# Altium schematic sheet IgnMOSFET.SchDoc
size A4
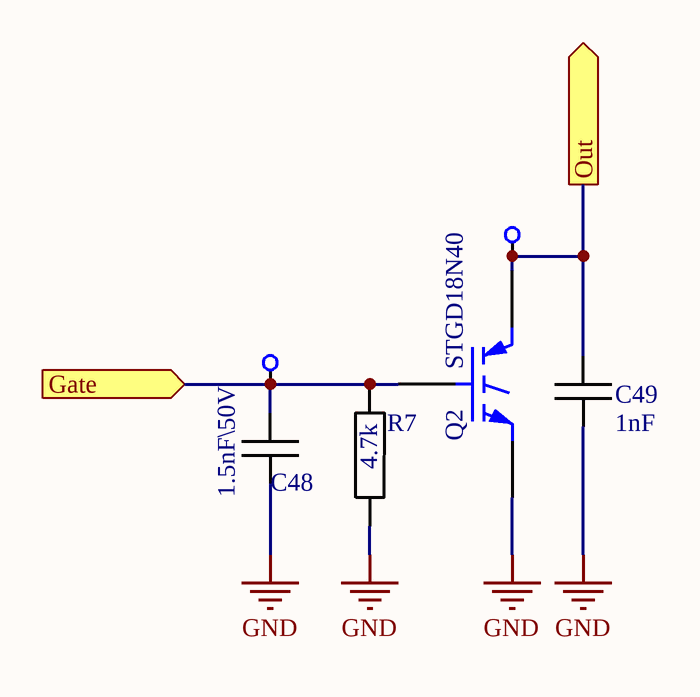
[diagram p0: IgnMOSFET.SchDoc]

## Parts
C48  1.5nF\50V  [SMD 0603]
C49  1nF  [SMD 0603]
Q2  STGD18N40  [DPAK228P991X238-3M]
R7  4.7k  [SMD 0603]
TP29  TestPoint  [TESTPOINT]  (value not drawn)
TP30  TestPoint  [TESTPOINT]  (value not drawn)

## Ports
Gate (in), Out (out)

## Nets
GND: C48.1 C49.1 Q2.3(E) R7.1
Gate: C48.2 Q2.1(G) R7.2 TP29.0 ; port Gate
Out: C49.2 Q2.4(C) TP30.0 ; port Out

## Library data of the parts
C48 = Capasitor: CC0603KRX7R9BB152; Value: 1.5nF\50V
C49 = Capasitor: CC0603KRX7R9BB102; Value: 1nF
Q2 = STGD18N40: IGBT Automotive-grade 390 V internally clamped  ESCIS 180 mJ; ComponentLink1Description: Datasheet; ComponentLink1URL: https://my.st.com/resource/en/datasheet/stgd18n40lz.pdf
R7 = Resistor: RC0603FR-074K7L; Value: 4.7k